# Altium schematic sheet Fight_Ctr_SCH.SchDoc
size A4
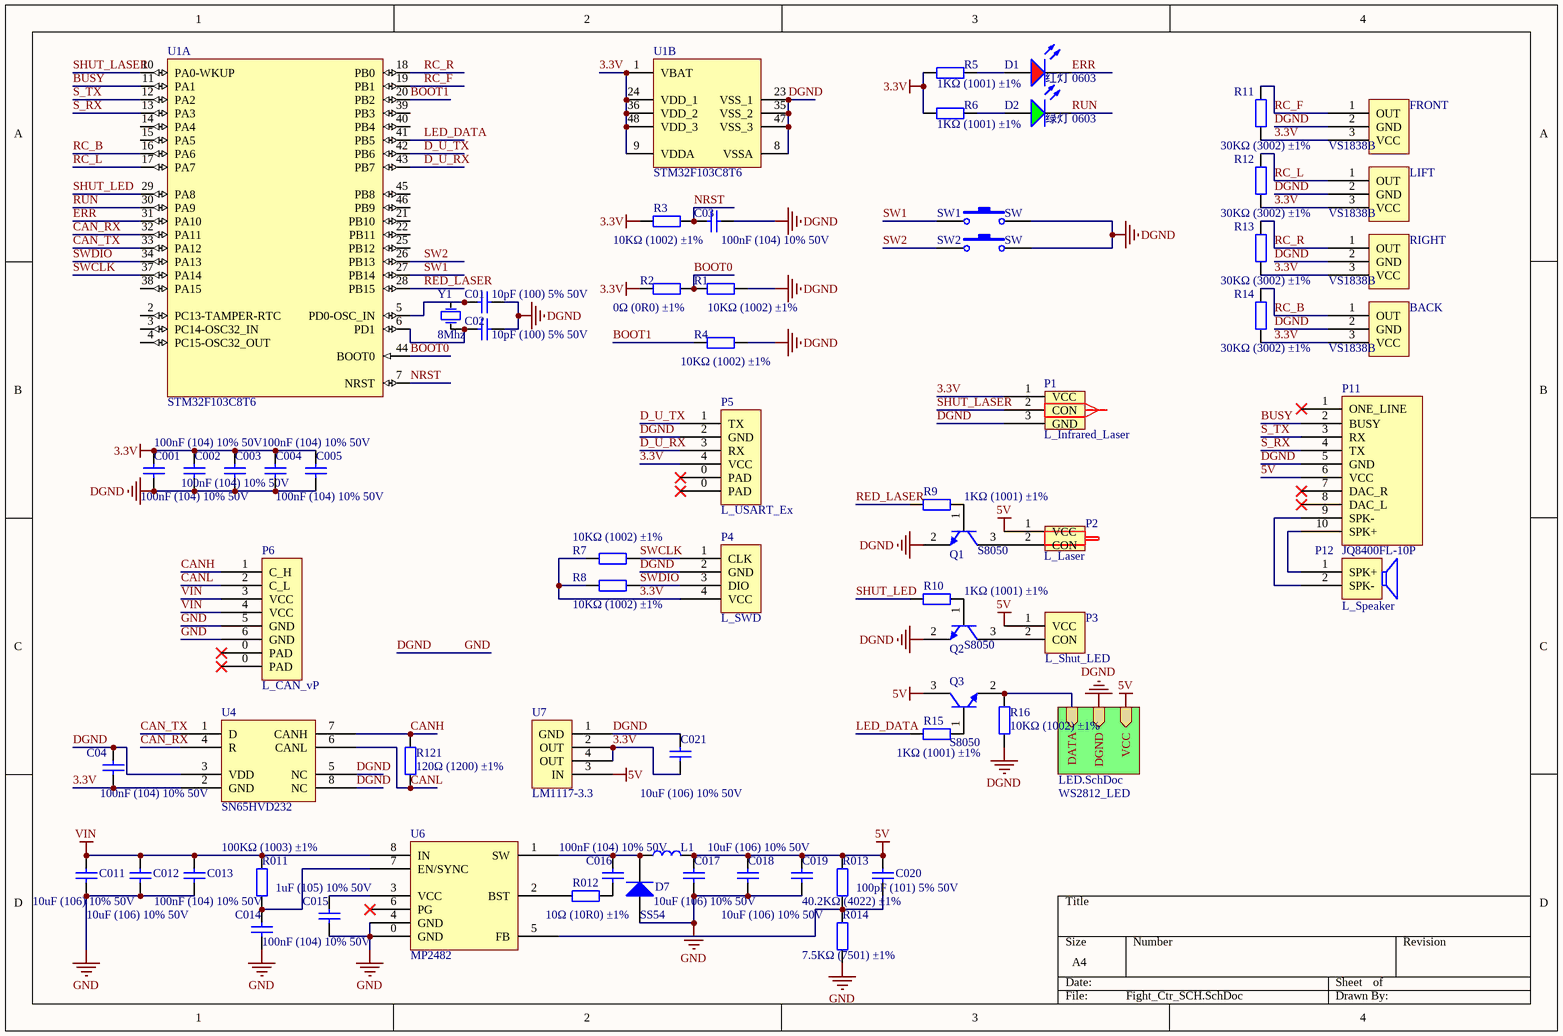
[diagram p0: Fight_Ctr_SCH.SchDoc]

## Parts
BACK  VS1838B  [LD_MOD]
C01  10pF (100) 5% 50V  [0603_C]
C001  100nF (104) 10% 50V  [0603_C]
C02  10pF (100) 5% 50V  [0603_C]
C002  100nF (104) 10% 50V  [0603_C]
C03  100nF (104) 10% 50V  [0603_C]
C003  100nF (104) 10% 50V  [0603_C]
C04  100nF (104) 10% 50V  [0603_C]
C004  100nF (104) 10% 50V  [0603_C]
C005  100nF (104) 10% 50V  [0603_C]
C011  10uF (106) 10% 50V  [1206_C]
C012  10uF (106) 10% 50V  [1206_C]
C013  100nF (104) 10% 50V  [0603_C]
C014  100nF (104) 10% 50V  [0603_C]
C015  1uF (105) 10% 50V  [0603_C]
C016  100nF (104) 10% 50V  [0603_C]
C017  10uF (106) 10% 50V  [1206_C]
C018  10uF (106) 10% 50V  [1206_C]
C019  10uF (106) 10% 50V  [1206_C]
C020  100pF (101) 5% 50V  [0603_C]
C021  10uF (106) 10% 50V  [1206_C]
D1  红灯 0603  [0603_LED_S1]
D2  绿灯 0603  [0603_LED_S1]
D7  SS54  [SMA(DO-214AC)_S1]
FRONT  VS1838B  [LD_MOD]
L1  Inductor  [1810]  (value not drawn)
LIFT  VS1838B  [LD_MOD]
P1  L_Infrared_Laser  [HDR3X1-2.54]
P2  L_Laser  [HDR2X1-2.54]
P3  L_Shut_LED  [HDR2X1-2.54]
P4  L_SWD  [MOLEX-53398-0471]
P5  L_USART_Ex  [BM04B-GHS-TBT]
P6  L_CAN_vP  [BM06B-GHS-TBT]
P11  JQ8400FL-10P  [JQ8400FL-10P]
P12  L_Speaker  [SPEAKER_TOUCH]
Q1  S8050  [SOP23-3]
Q2  S8050  [SOP23-3]
Q3  S8050  [SOP23-3]
R1  10KΩ (1002) ±1%  [0603_R]
R2  0Ω (0R0) ±1%  [0603_R]
R3  10KΩ (1002) ±1%  [0603_R]
R4  10KΩ (1002) ±1%  [0603_R]
R5  1KΩ (1001) ±1%  [0603_R]
R6  1KΩ (1001) ±1%  [0603_R]
R7  10KΩ (1002) ±1%  [0603_R]
R8  10KΩ (1002) ±1%  [0603_R]
R9  1KΩ (1001) ±1%  [0603_R]
R10  1KΩ (1001) ±1%  [0603_R]
R011  100KΩ (1003) ±1%  [0603_R]
R11  30KΩ (3002) ±1%  [0603_R]
R012  10Ω (10R0) ±1%  [0603_R]
R12  30KΩ (3002) ±1%  [0603_R]
R013  40.2KΩ (4022) ±1%  [0603_R]
R13  30KΩ (3002) ±1%  [0603_R]
R014  7.5KΩ (7501) ±1%  [0603_R]
R14  30KΩ (3002) ±1%  [0603_R]
R15  1KΩ (1001) ±1%  [0603_R]
R16  10KΩ (1002) ±1%  [0603_R]
R121  120Ω (1200) ±1%  [0603_R]
RIGHT  VS1838B  [LD_MOD]
SW1  SW  [SW-PB2-A1]
SW2  SW  [SW-PB2-A1]
U1  STM32F103C8T6  [LQFP-48_7x7x05P]  (parts A,B of 2)
U4  SN65HVD232  [SOIC-8]
U6  MP2482  [SOIC-8P]
U7  LM1117-3.3  [SOT223]
Y1  value 8Mhz  [5032]  (hidden comment: XTAL)

## Sub-sheets
WS2812_LED = LED.SchDoc: DATA (in), DGND (in), VCC (in)

## Nets
3.3V: BACK.3(VCC) C001.2 C002.2 C003.2 C04.1 C004.2 C005.2 C021.1 FRONT.3(VCC) LIFT.3(VCC) P1.1(VCC) P4.4(VCC) P5.4(VCC) R2.1 R3.1 R5.1 R6.1 R7.1 R8.1 R11.1 R12.1 R13.1 R14.1 RIGHT.3(VCC) U1.1(VBAT) U1.9(VDDA) U1.24(VDD_1) U1.36(VDD_2) U1.48(VDD_3) U4.2(GND) U7.2(OUT) U7.4(OUT)
5V: C017.2 C018.2 C019.2 C020.1 L1.2 P2.1(VCC) P3.1(VCC) P11.6(VCC) Q3.3(C) R013.2 U7.3(IN) ; sheet WS2812_LED/VCC
DGND: BACK.2(GND) C01.1 C001.1 C02.1 C002.1 C003.1 C03.2 C004.1 C04.2 C005.1 C011.1 C012.1 C013.1 C014.1 C015.1 C017.1 C018.1 C019.1 C021.2 D7.1(A) FRONT.2(GND) LIFT.2(GND) P1.3(GND) P4.2(GND) P5.2(GND) P6.5(GND) P6.6(GND) P11.5(GND) Q1.2(E) Q2.2(E) R1.2 R4.2 R014.1 R16.1 RIGHT.2(GND) SW1.2 SW2.2 U1.8(VSSA) U1.23(VSS_1) U1.35(VSS_2) U1.47(VSS_3) U4.3(VDD) U4.5(NC) U4.8(NC) U6.0(GND) U6.4(GND) U7.1(GND) ; sheet WS2812_LED/DGND  [also labelled GND]
VIN: C011.2 C012.2 C013.2 P6.3(VCC) P6.4(VCC) R011.2 U6.8(IN)
BOOT0: R1.1 R2.2 U1.44(BOOT0)
BOOT1: R4.1 U1.20(PB2)
BUSY: P11.2(BUSY) U1.11(PA1)
CAN_RX: U1.32(PA11) U4.4(R)
CAN_TX: U1.33(PA12) U4.1(D)
CANH: P6.1(C_H) R121.2 U4.7(CANH)
CANL: P6.2(C_L) R121.1 U4.6(CANL)
D_U_RX: P5.3(RX) U1.43(PB7)
D_U_TX: P5.1(TX) U1.42(PB6)
ERR: D1.K U1.31(PA10)
LED_DATA: R15.1 U1.41(PB5)
NRST: C03.1 R3.2 U1.7(NRST)
RC_B: BACK.1(OUT) R14.2 U1.16(PA6)
RC_F: FRONT.1(OUT) R11.2 U1.19(PB1)
RC_L: LIFT.1(OUT) R12.2 U1.17(PA7)
RC_R: R13.2 RIGHT.1(OUT) U1.18(PB0)
RED_LASER: R9.1 U1.28(PB15)
RUN: D2.K U1.30(PA9)
S_RX: P11.4(TX) U1.13(PA3)
S_TX: P11.3(RX) U1.12(PA2)
SHUT_LASER: P1.2(CON) U1.10(PA0-WKUP)
SHUT_LED: R10.1 U1.29(PA8)
SW1: SW1.1 U1.27(PB14)
SW2: SW2.1 U1.26(PB13)
SWCLK: P4.1(CLK) R7.2 U1.37(PA14)
SWDIO: P4.3(DIO) R8.2 U1.34(PA13)
NetC01_2: C01.2 U1.5(PD0-OSC_IN) Y1.2(OSC2)
NetC02_2: C02.2 U1.6(PD1) Y1.1(OSC1)
NetC014_2: C014.2 R011.1 U6.7(EN/SYNC)
NetC015_2: C015.2 U6.3(VCC)
NetC016_1: C016.1 R012.2
NetC016_2: C016.2 D7.2(K) L1.1 U6.1(SW)
NetC020_2: C020.2 R013.1 R014.2 U6.5(FB)
NetD1_A: D1.A R5.2
NetD2_A: D2.A R6.2
NetP2_2: P2.2(CON) Q1.3(C)
NetP3_2: P3.2(CON) Q2.3(C)
NetP11_9: P11.9(SPK-) P12.2(SPK-)
NetP11_10: P11.10(SPK+) P12.1(SPK+)
NetQ1_1: Q1.1(B) R9.2
NetQ2_1: Q2.1(B) R10.2
NetQ3_1: Q3.1(B) R15.2
NetQ3_2: Q3.2(E) R16.2 ; sheet WS2812_LED/DATA
NetR012_1: R012.1 U6.2(BST)

Not connected (* = marked no-connect by the designer): P5 0(PAD)*; P6 0(PAD)*; P11 1(ONE_LINE)* 7(DAC_R)* 8(DAC_L)*; U1 2(PC13-TAMPER-RTC) 3(PC14-OSC32_IN) 4(PC15-OSC32_OUT) 14(PA4) 15(PA5) 21(PB10) 22(PB11) 25(PB12) 38(PA15) 39(PB3) 40(PB4) 45(PB8) 46(PB9); U6 6(PG)*

## Library data of the parts
BACK FRONT LIFT RIGHT = VS1838B: 红外接收端
C01 C02 = 0603 10pF (100) 5% 50V: 贴片电容; ComponentLink1Description: 供应商链接; ComponentLink1URL: http://www.szlcsc.com/product/details_1986.html; Package: 0603; Supplier: LC; SuppliersPartNumber: C1634
C001 C002 C03 C003 C04 C004 C005 C013 C014 C016 = 0603 100nF (104) 10% 50V: 贴片电容; ComponentLink1Description: 供应商链接; ComponentLink1URL: http://www.szlcsc.com/product/details_15331.html; Package: 0603; Supplier: LC; SuppliersPartNumber: C14663
C011 C012 C017 C018 C019 C021 = 1206 10uF (106) 10% 50V: 贴片电容; ComponentLink1Description: 供应商链接; ComponentLink1URL: http://www.szlcsc.com/product/details_14236.html; Package: 1206; Supplier: LC; SuppliersPartNumber: C13585
C015 = 0603 1uF (105) 10% 50V: 贴片电容; ComponentLink1Description: 供应商链接; ComponentLink1URL: http://www.szlcsc.com/product/details_16531.html; Package: 0603; Supplier: LC; SuppliersPartNumber: C15849
C020 = 0603 100pF (101) 5% 50V: 贴片电容; ComponentLink1Description: 供应商链接; ComponentLink1URL: http://www.szlcsc.com/product/details_15530.html; Package: 0603; Supplier: LC; SuppliersPartNumber: C14858
D1 = 0603 红灯: 发光二极管; ComponentLink1Description: 供应商链接; ComponentLink1URL: http://www.szlcsc.com/product/details_2659.html; Package: 0603; Supplier: LC; SuppliersPartNumber: C2286
D2 = 0603 绿灯: 发光二极管; ComponentLink1Description: 供应商链接; ComponentLink1URL: http://www.szlcsc.com/product/details_73152.html; Package: 0603; Supplier: LC; SuppliersPartNumber: C72043
D7 = SMA(DO-214AC) SS54: 二极管; ComponentLink1Description: 供应商链接; ComponentLink1URL: http://www.szlcsc.com/product/details_23178.html; Package: SMA(DO-214AC); Supplier: LC; SuppliersPartNumber: C22452
L1 = Inductor: 贴片电感
P1 = L_Infrared_Laser: 红外激光连接器
P2 P3 = L_Laser: 瞄准激光连接器
P4 = L_SWD: SWD调试
P5 = L_USART_Ex: 串口扩展
P6 = L_CAN_vP: 带电源CAN接口
P11 = JQ8400FL-10P: 音频模块
P12 = L_Speaker: 扬声器接口
Q1-Q3 = S8050: 三极管
R1 R3 R4 R7 R8 R16 = 0603 10KΩ (1002) 1%: 贴片电阻; ComponentLink1Description: 供应商链接; ComponentLink1URL: http://www.szlcsc.com/product/details_26547.html; Package: 0603; Supplier: LC; SuppliersPartNumber: C25804
R2 = 0603 0Ω (0R0) 1%: 贴片电阻; ComponentLink1Description: 供应商链接; ComponentLink1URL: http://www.szlcsc.com/product/details_21903.html; Package: 0603; Supplier: LC; SuppliersPartNumber: C21189
R5 R6 R9 R10 R15 = 0603 1KΩ (1001) 1%: 贴片电阻; ComponentLink1Description: 供应商链接; ComponentLink1URL: http://www.szlcsc.com/product/details_21904.html; Package: 0603; Supplier: LC; SuppliersPartNumber: C21190
R011 = 0603 100KΩ (1003) 1%: 贴片电阻; ComponentLink1Description: 供应商链接; ComponentLink1URL: http://www.szlcsc.com/product/details_26546.html; Package: 0603; Supplier: LC; SuppliersPartNumber: C25803
R11-R14 = 0603 30KΩ (3002) 1%: 贴片电阻; ComponentLink1Description: 供应商链接; ComponentLink1URL: http://www.szlcsc.com/product/details_23711.html; Package: 0603; Supplier: LC; SuppliersPartNumber: C22984
R012 = 0603 10Ω (10R0) 1%: 贴片电阻; ComponentLink1Description: 供应商链接; ComponentLink1URL: http://www.szlcsc.com/product/details_23586.html; Package: 0603; Supplier: LC; SuppliersPartNumber: C22859
R013 = 0603 40.2KΩ (4022) 1%: 贴片电阻; ComponentLink1Description: 供应商链接; ComponentLink1URL: http://www.szlcsc.com/product/details_13081.html; Package: 0603; Supplier: LC; SuppliersPartNumber: C12447
R014 = 0603 7.5KΩ (7501) 1%: 贴片电阻; ComponentLink1Description: 供应商链接; ComponentLink1URL: http://www.szlcsc.com/product/details_23961.html; Package: 0603; Supplier: LC; SuppliersPartNumber: C23234
R121 = 0603 120Ω (1200) 1%: 贴片电阻; ComponentLink1Description: 供应商链接; ComponentLink1URL: http://www.szlcsc.com/product/details_23514.html; Package: 0603; Supplier: LC; SuppliersPartNumber: C22787
SW1 SW2 = SW: 微动开关
U1 = STM32F103C8T6: ARM; ComponentLink1Description: 供应商链接; ComponentLink1URL: http://www.szlcsc.com/product/details_9243.html; Package: LQFP-48_7x7x05P; Supplier: LC; SuppliersPartNumber: C8734
U4 = SN65HVD232: SOIC-8
U6 = MP2482: DC-DC
U7 = LM1117-3.3: 线性稳压
Y1 = XTAL: 无源晶振